# EAGLE design lipoMolex (EAGLE 5.11)
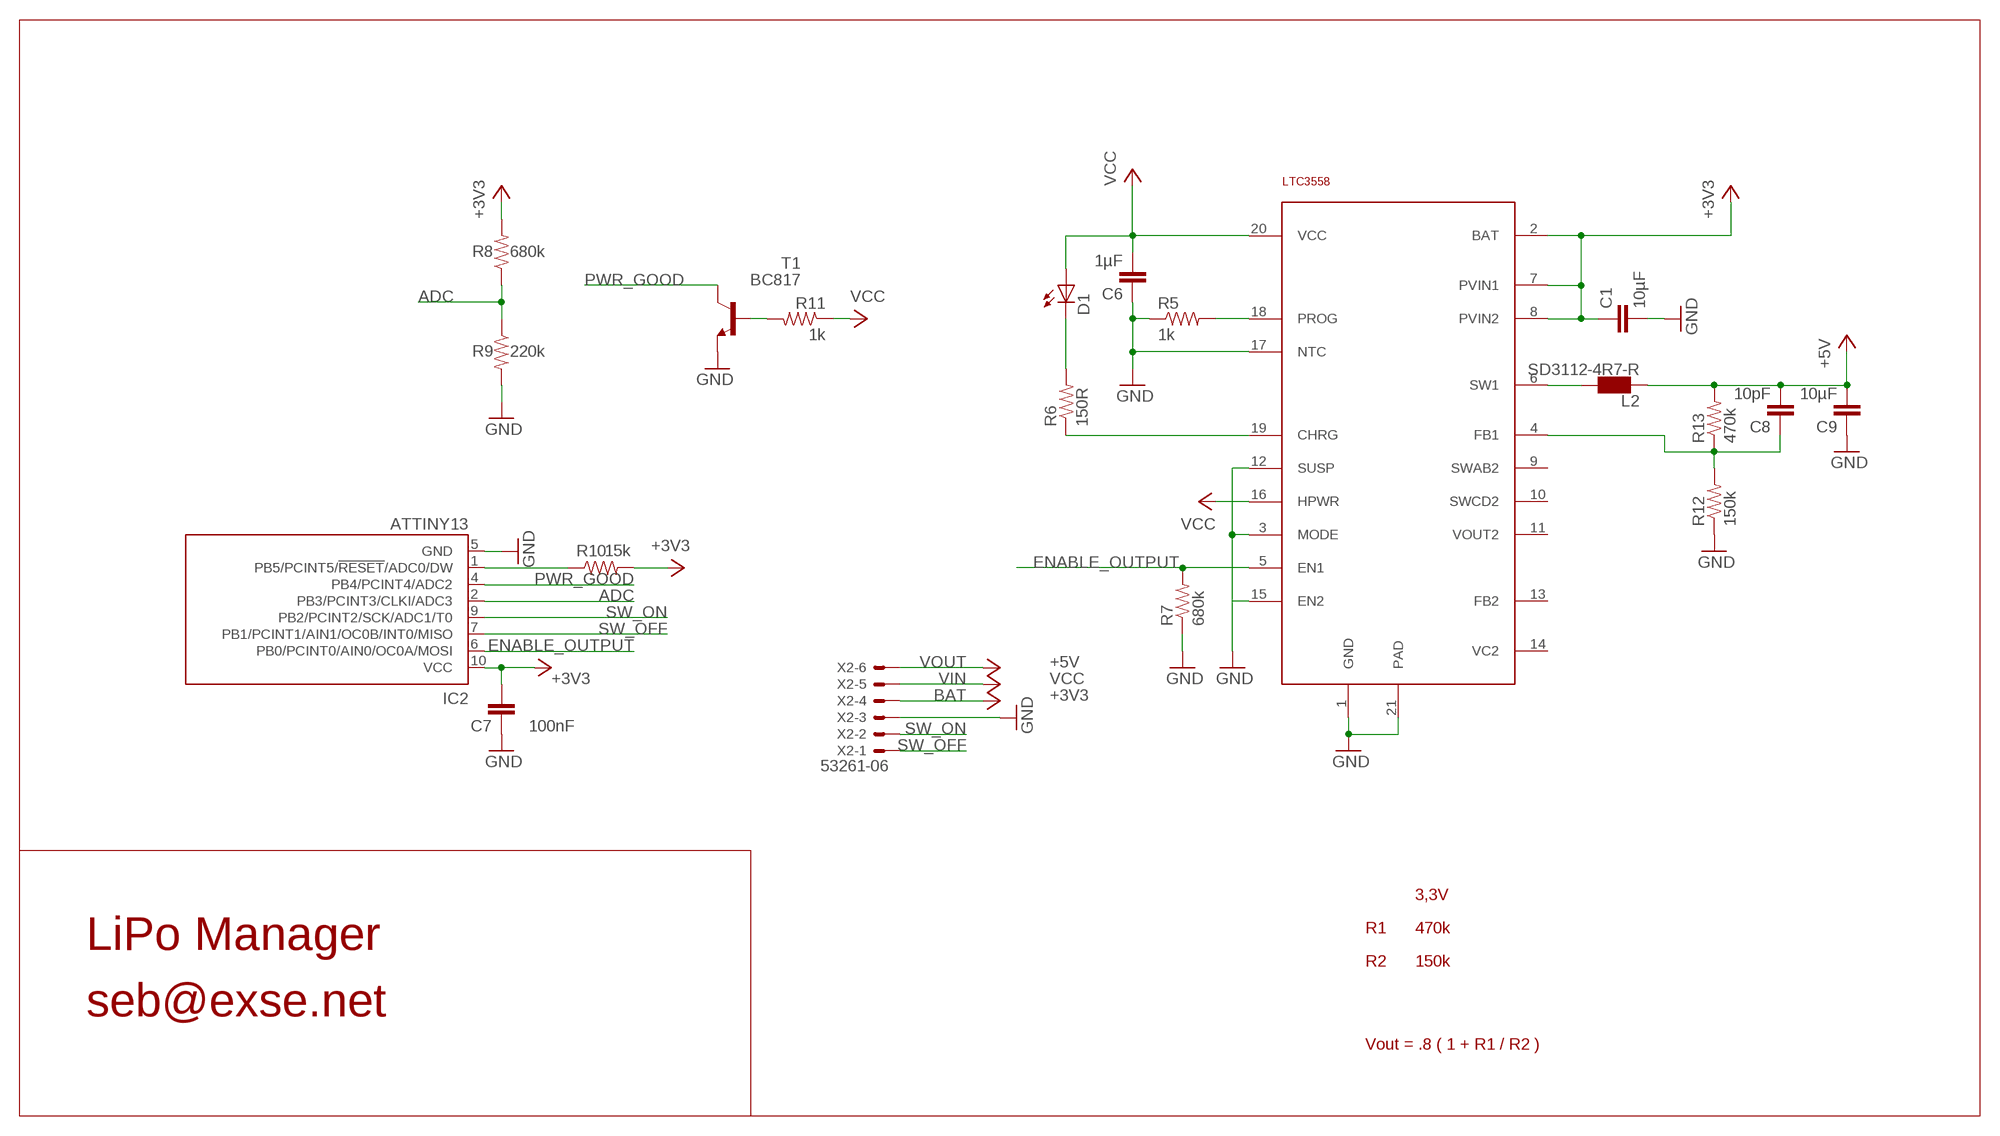
[diagram p0: schematic, sheet 1]

## Parts
C1  10µF  CAP0805  [0805]
C6  1µF  CAP0805  [0805]
C7  100nF  CAP0805  [0805]
C8  10pF  CAP0805  [0805]
C9  10µF  CAP0805  [0805]
D1  LEDCHIPLED_0805  [CHIPLED_0805]
IC1  LTC3558  [UD-QFN20]
IC2  ATTINY13  TINY13-20MM0  [10M1]
L2  SD3112-4R7-R  SD3112  [SD3112]
R5  1k  RESISTOR0402-RES  [0402-RES]
R6  150R  RESISTOR0402-RES  [0402-RES]
R7  680k  RESISTOR0402-RES  [0402-RES]
R8  680k  RESISTOR0402-RES  [0402-RES]
R9  220k  RESISTOR0402-RES  [0402-RES]
R10  15k  RESISTOR0402-RES  [0402-RES]
R11  1k  RESISTOR0402-RES  [0402-RES]
R12  150k  RESISTOR0402-RES  [0402-RES]
R13  470k  RESISTOR0402-RES  [0402-RES]
T1  BC817  BC847  [SOT23]
X2  53261-06  [53261-06]

## Nets
ADC: IC2.2(PB3/PCINT3/CLKI/ADC3) R8.1 R9.1
BAT: C1.1 C7.2 IC1.2(BAT) IC1.7(PVIN1) IC1.8(PVIN2) IC2.10(VCC) R8.2 R10.2 X2.4 ; supply symbol labelled +3V3
ENABLE_OUTPUT: IC1.5(EN1) IC2.6(PB0/PCINT0/AIN0/OC0A/MOSI) R7.2
GND: C1.2 C6.1 C7.1 C9.1 IC1.1(GND) IC1.3(MODE) IC1.12(SUSP) IC1.15(EN2) IC1.17(NTC) IC1.21(PAD) IC2.5(GND) R5.1 R7.1 R9.2 R12.1 T1.2(E) X2.3
N$1: C8.1 IC1.4(FB1) R12.2 R13.1
N$2: D1.C R6.2
N$3: IC1.18(PROG) R5.2
N$4: IC1.6(SW1) L2.P$1
N$10: IC1.19(CHRG) R6.1
N$11: R11.2 T1.1(B)
N$13: IC2.1(PB5/PCINT5/!RESET!/ADC0/DW) R10.1
PWR_GOOD: IC2.4(PB4/PCINT4/ADC2) T1.3(C)
SW_OFF: IC2.7(PB1/PCINT1/AIN1/OC0B/INT0/MISO) X2.1
SW_ON: IC2.9(PB2/PCINT2/SCK/ADC1/T0) X2.2
VIN: C6.2 D1.A IC1.16(HPWR) IC1.20(VCC) R11.1 X2.5 ; supply symbol labelled VCC
VOUT: C8.2 C9.2 L2.P$2 R13.2 X2.6 ; supply symbol labelled +5V
Unconnected: IC1.9(SWAB2) IC1.10(SWCD2) IC1.11(VOUT2) IC1.13(FB2) IC1.14(VC2)

## Notes on the sheet
- 3,3V
- R1 | 470k
- LiPo Manager
- R2 | 150k
- seb@exse.net
- Vout = .8 ( 1 + R1 / R2 )

## Power pins joined to a net without a drawn wire
GND: IC2.11(GND)

## Library data of the parts
C1 C6-C9 = SparkFun:CAP: Capacitor Standard 0603 ceramic capacitor, and 0.1" leaded capacitor.
D1 = led:LED: LED OSRAM: - CHIPLED LG R971, LG N971, LY N971, LG Q971, LY Q971, LO R971, LY R971 LH N974, LH R974 LS Q976, LO Q976, LY Q976 LO Q996 - Hyper CHIPLED LW Q18S LB Q993, LB Q99A, LB R99A - SideLED LS A670, LO A670, LY A670, LG A670, LP A670 LB A673, LV A673, LT A673, LW A673 LH A674 LY A675 LS A676, LA A676, LO A676, LY A676, LW A676 LS A679, LY A679, LG A679 - Hyper Micro SIDELED® LS Y876, LA Y876, LO Y876, LY Y876 LT Y87S - SmartLED LW L88C, LW L88S LB L89C, LB L89S, LG L890 LS L89K, LO L89K, LY L89K LS L896, LA L896, LO L896, LY L896 - TOPLED LS T670, LO T670, LY T670, LG T670, LP T670 LSG T670, LSP T670, LSY T670, LOP T670, LYG T670 LG T671, LOG T671, LSG T671 LB T673, LV T673, LT T673, LW T673 LH T674 LS T676, LA T676, LO T676, LY T676, LB T676, LH T676, LSB T676, LW T676 LB T67C, LV T67C, LT T67C, LS T67K, LO T67K, LY T67K, LW E67C LS E67B, LA E67B, LO E67B, LY E67B, LB E67C, LV E67C, LT E67C LW T67C LS T679, LY T679, LG T679 LS T770, LO T770, LY T770, LG T770, LP T770 LB T773, LV T773, LT T773, LW T773 LH T774 LS E675, LA E675, LY E675, LS T675 LS T776, LA T776, LO T776, LY T776, LB T776 LHGB T686 LT T68C, LB T68C - Hyper Mini TOPLED® LB M676 - Mini TOPLED Santana® LG M470 LS M47K, LO M47K, LY M47K Source: http://www.osram.convergy.de LUXEON: - LUMILED® LXK2-PW12-R00, LXK2-PW12-S00, LXK2-PW14-U00, LXK2-PW14-V00 LXK2-PM12-R00, LXK2-PM12-S00, LXK2-PM14-U00 LXK2-PE12-Q00, LXK2-PE12-R00, LXK2-PE12-S00, LXK2-PE14-T00, LXK2-PE14-U00 LXK2-PB12-K00, LXK2-PB12-L00, LXK2-PB12-M00, LXK2-PB14-N00, LXK2-PB14-P00, LXK2-PB14-Q00 LXK2-PR12-L00, LXK2-PR12-M00, LXK2-PR14-Q00, LXK2-PR14-R00 LXK2-PD12-Q00, LXK2-PD12-R00, LXK2-PD12-S00 LXK2-PH12-R00, LXK2-PH12-S00 LXK2-PL12-P00, LXK2-PL12-Q00, LXK2-PL12-R00 Source: www.luxeon.com KINGBRIGHT: KA-3528ASYC Source: www.kingbright.com
IC1 = seb:LTC3558
IC2 = atmel:TINY13*: 8-bit AVR Microcontroller with 1K Bytes In-System Programmable Flash Source: http://www.atmel.com/dyn/resources/prod_documents/2535S.pdf; MPN: ATTINY13A-MMU; OC_FARNELL: 1715516; OC_NEWARK: 15R0298
L2 = seb:SD3112
R5-R13 = SparkFun:RESISTOR: Resistor Basic schematic elements and footprints for 0603, 1206, and PTH resistors.
T1 = transistor:BC847: NPN TRANSISTOR
X2 = con-molex:53?-06: CONNECTOR wire to board 1.25 mm (.049 inch) pitch header; OC_FARNELL: 1125375; OC_NEWARK: unknown

## Board
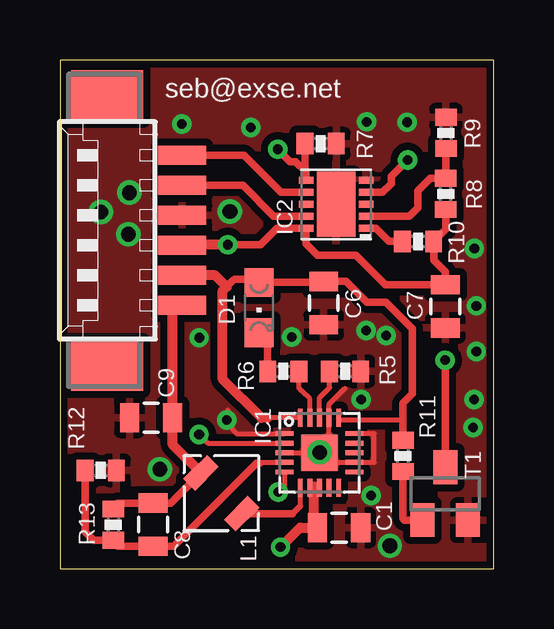
[diagram p1: board, top side]
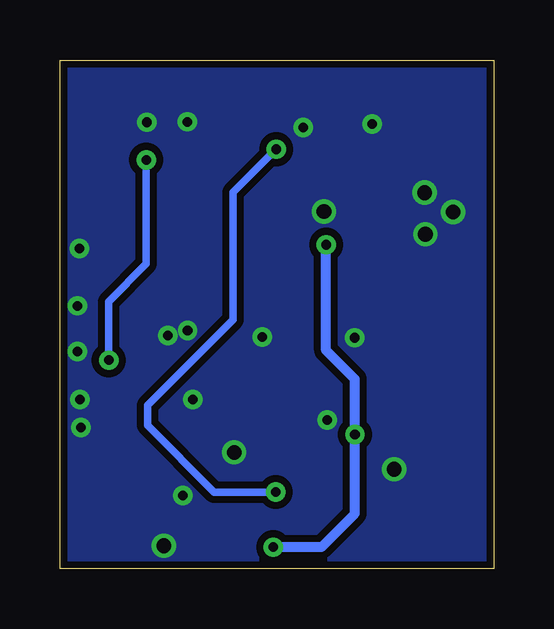
[diagram p2: board, bottom side, seen from below]

Size 18.1 x 21.2 mm. Coordinates in mm from the lower left corner, seen from the top.
Outline: 0,0 18.1,0 18.1,21.2 0,21.2 0,0
Copper layers (1*16): Top 0.035mm / dielectric 1.5mm / Bottom 0.035mm
Design rules "default *": minimum track width 0.2mm, minimum drill 0.3mm, track to track 0.2mm, track to pad 0.2mm, pad to pad 0.2mm, via to via 0.2mm, smd to smd 0.2mm, copper to edge 0.2mm, drill to drill 0.2mm, minimum pad ring 10mil, minimum via ring 8mil, stop-mask expansion 4mil, vias tented up to drill 100mil, thermal gap 10mil

### Footprints (pad centres in the part's own frame; a part is rotated, then mirrored left to right if it is on the bottom)
0805 = smd 0.8 x 1.2: 1 -0.9,0; 2 0.9,0
CHIPLED_0805 = smd 1.2 x 1.2: A 0,-1.05; C 0,1.05
UD-QFN20 = smd 0.751 x 0.2: 1 -1.451,0.8; 2 -1.451,0.4; 3 -1.451,0; 4 -1.451,-0.4; 5 -1.451,-0.8; 11 1.451,-0.8; 12 1.451,-0.4; 13 1.451,0; 14 1.451,0.4; 15 1.451,0.8 | smd 0.2 x 0.751: 6 -0.8,-1.451; 7 -0.4,-1.451; 8 0,-1.451; 9 0.4,-1.451; 10 0.8,-1.451; 16 0.8,1.451; 17 0.4,1.451; 18 0,1.451; 19 -0.4,1.451; 20 -0.8,1.451 | smd 1.5 x 1.5: 21 0,0
10M1 = smd 0.6 x 0.3: 1 -1.25,1; 2 -1.25,0.5; 3 -1.25,0; 4 -1.25,-0.5; 5 -1.25,-1; 6 1.25,-1; 7 1.25,-0.5; 8 1.25,0; 9 1.25,0.5; 10 1.25,1 | smd 1.6 x 2.7: 11 0,0
SD3112 = smd 0.7 x 1.4: P$1 -1.2,0; P$2 1.2,0
0402-RES = smd 0.7 x 0.9: 1 -0.65,0; 2 0.65,0
SOT23 = smd 1 x 1.4: 1 -0.95,-1.1; 2 0.95,-1.1; 3 0,1.1
53261-06 = smd 0.8 x 2: 1 3.125,-2.5; 2 1.875,-2.5; 3 0.625,-2.5; 4 -0.625,-2.5; 5 -1.875,-2.5; 6 -3.125,-2.5 | smd 2.1 x 3: S1 5.625,0.625; S2 -5.625,0.625

### Placement (x,y rotation side)
C1  11.64,1.71 0 top
C6  11,11.07 90 top
C7  16.07,10.93 90 top
C8  3.88,1.84 90 top
C9  3.8,6.3 0 top
D1  8.3,10.88 180 top
IC1  10.82,4.84 0 top
IC2  11.51,15.19 180 top
L2  6.73,3.15 135 top
R5  11.89,8.23 180 top
R6  9.31,8.22 180 top
R7  10.87,17.72 180 top
R8  16.09,15.62 270 top
R9  16.1,18.16 90 top
R10  14.94,13.64 0 top
R11  14.31,4.7 270 top
R12  1.7,4.1 180 top
R13  2.23,1.84 90 top
T1  16.07,3.13 0 top
X2  2.6,14.1 90 top

### Tracks (layer width: path | path; a pad name or v marks a point on that pad's centre or on a via)
ADC
  Top 0.305: R9.1 16.1,16.29 R8.1 15.46,16.27 14.94,15.75 14.94,15.04 14.58,14.69 IC2.2
BAT  (via drill 0.4)
  Top 0.2: IC1.8 10.6,3.44 IC1.7 10.46,3.44 10.6,3.3 | C1.1 10.6,2.06 10.6,2.2 | v5.8,5.6 6.16,5.24 IC1.2
  Top 0.305: C7.2 14.97,11.83 | C7.2 13.57,11.83 12.34,13.06 10.74,13.06 10.26,13.54 IC2.10 9.05,14.19 8.37,13.5 v7,13.5 | C7.2 16.07,12.38 15.59,12.86 R10.2 16.09,14.14 R8.2
  Top 0.406: 10.6,2.2 10.6,3.3 10.6,3.44 | X2.4 5.1,13.5 v7,13.5 | v9.2,0.9 10.01,1.71 C1.1
  Bottom 0.254: v7,13.5 7,13.6
  Bottom 0.406: v7,13.5 7,9.1 5.8,7.9 v5.8,5.6 5.8,2.3 7.2,0.9 v9.2,0.9
ENABLE_OUTPUT  (via drill 0.4)
  Top 0.2: v9.1,3.2 9.37,3.47 IC1.5
  Top 0.305: v9.08,17.48 9.59,16.97 9.83,16.97 10.26,16.54 IC2.6 10.22,16.23 R7.2
  Bottom 0.305: v9.08,17.48 10.87,15.69 10.87,10.39 14.44,6.82 14.44,5.97 11.66,3.2 v9.1,3.2
GND  (via drill 0.4 pad 0.3, 0.6 pad 0.3, 0.61 pad 0.3)
  Top 0.2: IC1.1 7.36,5.64 7,6 7,6.62 | IC1.3 IC1.21 | 10.32,4.44 IC1.12 13.1,4.44 13.1,5.64 IC1.15 | 11.22,5.64 11.22,6.85 11.89,7.52
  Top 0.203: IC1.17 11.22,5.64 11.22,5.14 IC1.21
  Top 0.254: IC1.21 10.32,4.44
  other vias: 1.71,14.87 13.76,0.96 17.27,7.06 2.86,13.94 4.16,4.15 10.83,4.85 17.28,13.35 5.8,9.63 17.22,5.89 12.98,3.06 7.09,14.88 2.89,15.67 14.48,18.61 12.78,9.93 5.08,18.54 7.96,18.39 17.37,9.06 12.57,7.06 9.67,9.66 17.37,10.96 13.6,9.73 6.96,6.2 12.79,18.62
  pour Top (isolate 0.3): 0.04,21.21 18.07,21.13 18.14,0.04 0.02,0.02
  pour Bottom (isolate 0.3): 0.03,21.16 -0.04,-0.03 18.12,0.03 18.08,21.12
N$1
  Top 0.2: 8.4,4.4 8.44,4.44 IC1.4
  Top 0.254: R13.1 2.41,0.94 | 8.2,4.4 8.4,4.4
  Top 0.305: 2.41,0.94 C8.1 4.74,0.94 5.2,1.4 8.2,4.4 | R13.1 1.41,1.19 1.1,1.5 1.05,1.55 R12.2
N$2
  Top 0.305: R6.2 8.66,9.47 D1.C
N$3
  Top 0.2: IC1.18 10.82,7.12 11.2,7.5 11.24,7.54 R5.2
N$4
  Top 0.2: 10.02,2.62 IC1.6
  Top 0.254: 9.7,2.3 10.02,2.62
  Top 0.305: L2.P$1 9.7,2.3
N$10
  Top 0.2: IC1.19 10.42,7.08 10.1,7.4 9.96,7.54 R6.1
N$11
  Top 0.305: T1.1 14.37,2.03 14.3,2.1 14.3,3.8 R11.2
N$13
  Top 0.305: IC2.1 13.17,14.19 13.72,13.64 R10.1
PWR_GOOD  (via drill 0.4)
  Top 0.305: T1.3 v16.07,8.69 | 14.31,16.85 v14.5,17.04 13.82,16.36 13.82,16.05 13.45,15.69 IC2.4
  Bottom 0.305: v14.5,17.04 14.5,15.72 14.5,12.7 16.07,11.14 v16.07,8.69
SW_OFF
  Top 0.305: X2.1 7.67,17.23 9.21,15.69 IC2.7
SW_ON
  Top 0.305: X2.2 7.62,15.98 8.91,14.69 IC2.9
VIN
  Top 0.2: IC1.16 11.66,6.2 14.3,6.2 14.3,6.4
  Top 0.203: IC1.20 8.65,6.29
  Top 0.305: 6.95,11.75 7.2,12 7.27,12.07 8.16,12.07 D1.A 10.46,11.93 C6.2 11.93,11.97 12.8,11.1 13.6,11.1 14.7,10 14.7,7.3 14.3,6.9 14.3,6.4 14.3,5.41 14.33,5.38 | 14.33,5.38 R11.1 14.33,5.38
  Top 0.406: X2.5 6.47,12.23 6.95,11.75 6.79,11.59 6.79,7.9 8.4,6.29 8.65,6.29
VOUT
  Top 0.254: R13.2 2.41,2.74
  Top 0.305: 2.41,2.74 C8.2 4.62,2.74 L2.P$2
  Top 0.406: L2.P$2 4.7,5.18 C9.2 4.7,10.98 X2.6

### Text on the board
tNames: seb@exse.net | L1
bStop: OFF | ON | GND | BAT | Vin | Vout | LiPo-Controller | seb@exse.net
tDocu: OFF_SW | ON_SW | GND | Vin | GND | Vbat | GND | Vout